# Altium schematic sheet MAIN_BOARD.SchDoc
size C
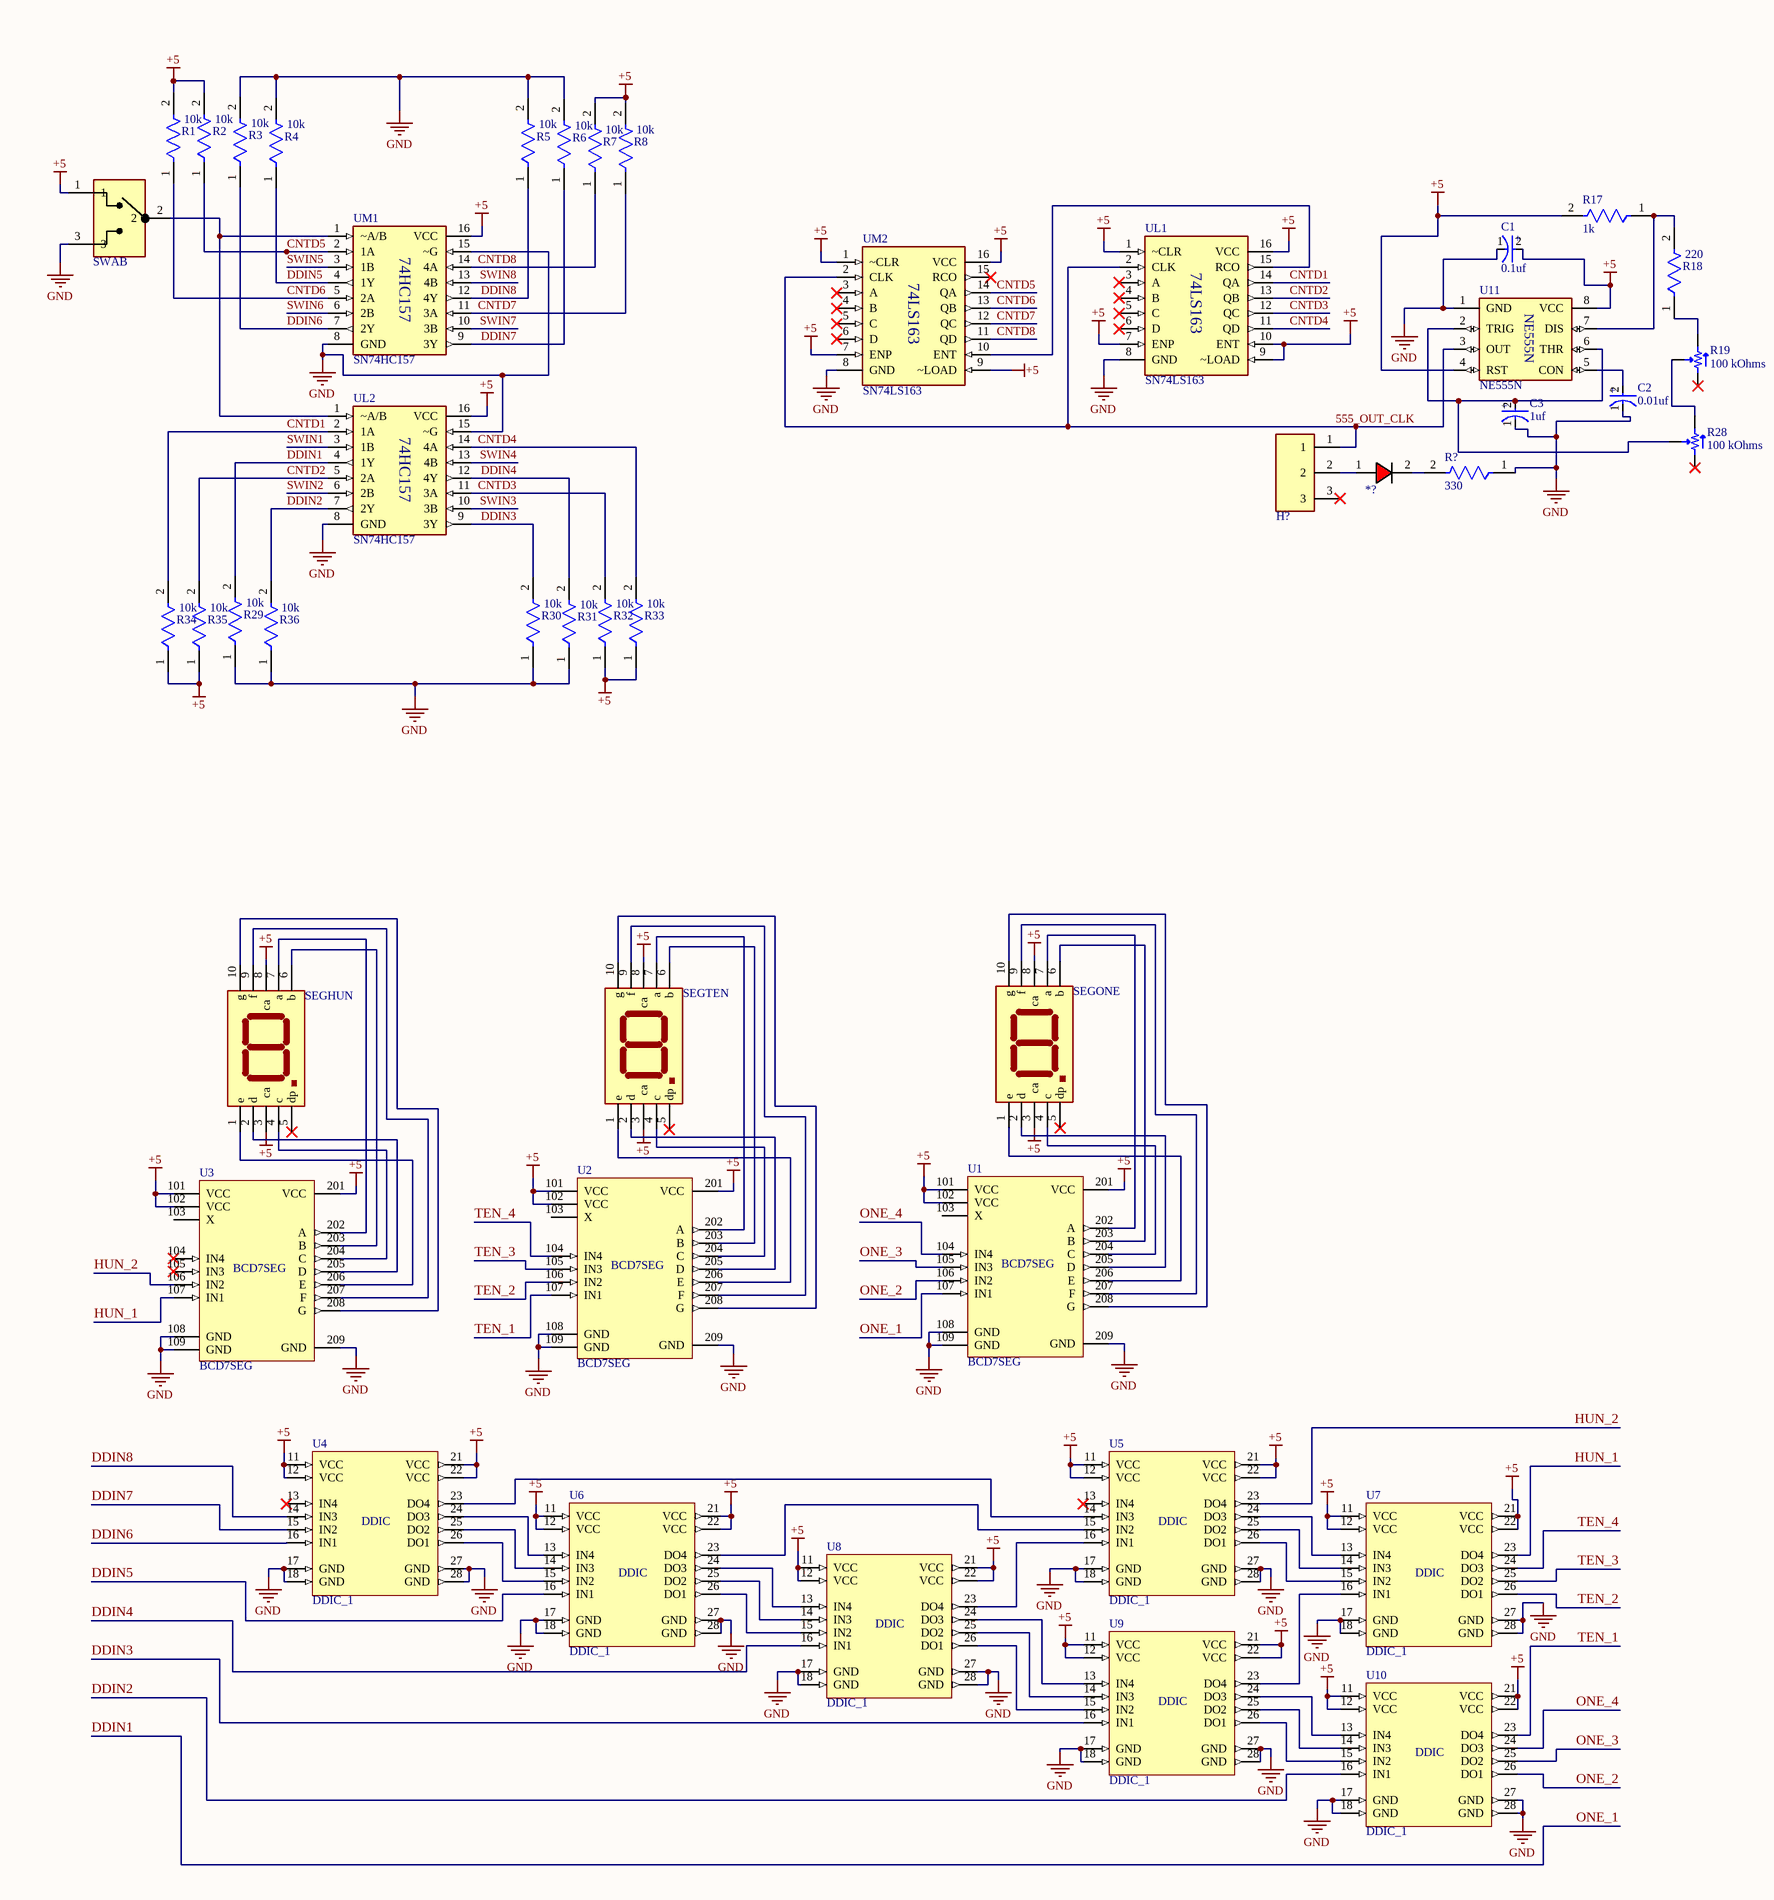
[diagram p0: MAIN_BOARD.SchDoc, left]
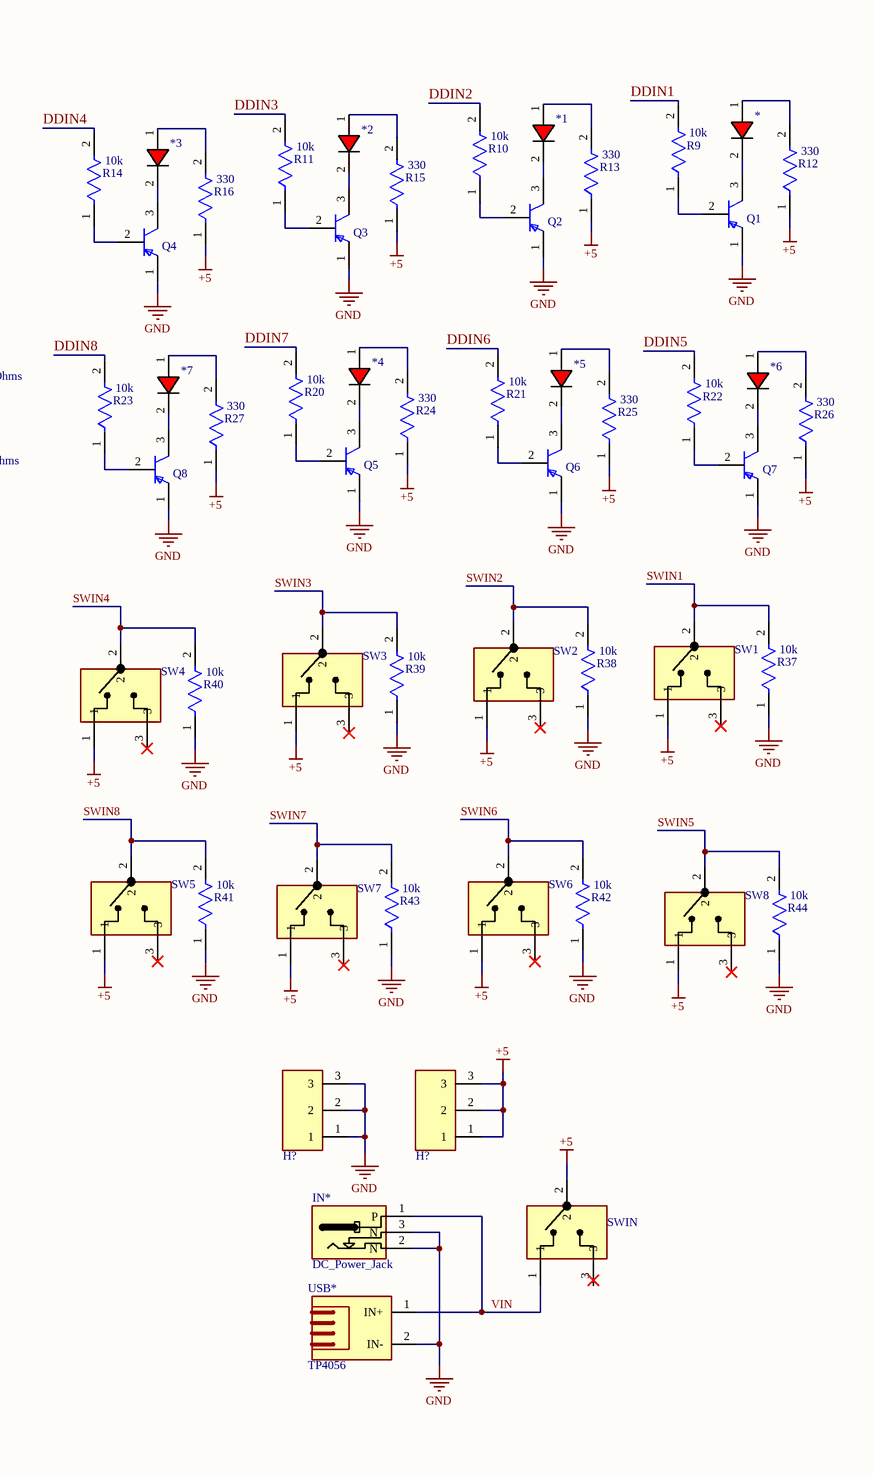
[diagram p1: MAIN_BOARD.SchDoc, right]

## Parts
(Parts that share a designator on the sheet are numbered #1, #2 ... from top to bottom, then left to right.)
*  5mm_RED_LED_3V  [5mm_LED_3V]  (value not drawn)
*1  5mm_RED_LED_3V  [5mm_LED_3V]  (value not drawn)
*2  5mm_RED_LED_3V  [5mm_LED_3V]  (value not drawn)
*3  5mm_RED_LED_3V  [5mm_LED_3V]  (value not drawn)
*4  5mm_RED_LED_3V  [5mm_LED_3V]  (value not drawn)
*5  5mm_RED_LED_3V  [5mm_LED_3V]  (value not drawn)
*6  5mm_RED_LED_3V  [5mm_LED_3V]  (value not drawn)
*7  5mm_RED_LED_3V  [5mm_LED_3V]  (value not drawn)
*?  5mm_RED_LED_3V  [5mm_LED_3V]  (value not drawn)
C1  val: 0.1uf  [Cornell_Dubilier_SK010M050ST_0 - duplicate]  (hidden comment: SK010M050ST_1)
C2  val: 0.01uf  [Cornell_Dubilier_SK010M050ST_0 - duplicate]  (hidden comment: SK010M050ST_1)
C3  val: 1uf  [Cornell_Dubilier_SK010M050ST_0 - duplicate]  (hidden comment: SK010M050ST_1)
H?#1  2.54mm_TH_1x3_pin_header  [2.54mm_TH_1x3_pin_header]  (value not drawn)
H?#2  2.54mm_TH_1x3_pin_header  [2.54mm_TH_1x3_pin_header]  (value not drawn)
H?#3  2.54mm_TH_1x3_pin_header  [2.54mm_TH_1x3_pin_header]  (value not drawn)
IN*  DC_Power_Jack  [DC_Female_Jack]
Q1  BC640TA  [ON_Semiconductor_135AR_MFG]  (value not drawn)
Q2  BC640TA  [ON_Semiconductor_135AR_MFG]  (value not drawn)
Q3  BC640TA  [ON_Semiconductor_135AR_MFG]  (value not drawn)
Q4  BC640TA  [ON_Semiconductor_135AR_MFG]  (value not drawn)
Q5  BC640TA  [ON_Semiconductor_135AR_MFG]  (value not drawn)
Q6  BC640TA  [ON_Semiconductor_135AR_MFG]  (value not drawn)
Q7  BC640TA  [ON_Semiconductor_135AR_MFG]  (value not drawn)
Q8  BC640TA  [ON_Semiconductor_135AR_MFG]  (value not drawn)
R1  VAL: 10k  [TH_Resistor_vertical]  (hidden comment: Res_virtical)
R2  VAL: 10k  [TH_Resistor_vertical]  (hidden comment: Res_virtical)
R3  VAL: 10k  [TH_Resistor_vertical]  (hidden comment: Res_virtical)
R4  VAL: 10k  [TH_Resistor_vertical]  (hidden comment: Res_virtical)
R5  VAL: 10k  [TH_Resistor_vertical]  (hidden comment: Res_virtical)
R6  VAL: 10k  [TH_Resistor_vertical]  (hidden comment: Res_virtical)
R7  VAL: 10k  [TH_Resistor_vertical]  (hidden comment: Res_virtical)
R8  VAL: 10k  [TH_Resistor_vertical]  (hidden comment: Res_virtical)
R9  VAL: 10k  [TH_Resistor_vertical]  (hidden comment: Res_virtical)
R10  VAL: 10k  [TH_Resistor_vertical]  (hidden comment: Res_virtical)
R11  VAL: 10k  [TH_Resistor_vertical]  (hidden comment: Res_virtical)
R12  VAL: 330  [TH_Resistor_vertical]  (hidden comment: Res_virtical)
R13  VAL: 330  [TH_Resistor_vertical]  (hidden comment: Res_virtical)
R14  VAL: 10k  [TH_Resistor_vertical]  (hidden comment: Res_virtical)
R15  VAL: 330  [TH_Resistor_vertical]  (hidden comment: Res_virtical)
R16  VAL: 330  [TH_Resistor_vertical]  (hidden comment: Res_virtical)
R17  VAL: 1k  [TH_Resistor_vertical]  (hidden comment: Res_virtical)
R18  VAL: 220  [TH_Resistor_vertical]  (hidden comment: Res_virtical)
R19  100 kOhms  [BOURNS TRIMPOT 3386P-1]
R20  VAL: 10k  [TH_Resistor_vertical]  (hidden comment: Res_virtical)
R21  VAL: 10k  [TH_Resistor_vertical]  (hidden comment: Res_virtical)
R22  VAL: 10k  [TH_Resistor_vertical]  (hidden comment: Res_virtical)
R23  VAL: 10k  [TH_Resistor_vertical]  (hidden comment: Res_virtical)
R24  VAL: 330  [TH_Resistor_vertical]  (hidden comment: Res_virtical)
R25  VAL: 330  [TH_Resistor_vertical]  (hidden comment: Res_virtical)
R26  VAL: 330  [TH_Resistor_vertical]  (hidden comment: Res_virtical)
R27  VAL: 330  [TH_Resistor_vertical]  (hidden comment: Res_virtical)
R28  100 kOhms  [BOURNS TRIMPOT 3386P-1]
R29  VAL: 10k  [TH_Resistor_vertical]  (hidden comment: Res_virtical)
R30  VAL: 10k  [TH_Resistor_vertical]  (hidden comment: Res_virtical)
R31  VAL: 10k  [TH_Resistor_vertical]  (hidden comment: Res_virtical)
R32  VAL: 10k  [TH_Resistor_vertical]  (hidden comment: Res_virtical)
R33  VAL: 10k  [TH_Resistor_vertical]  (hidden comment: Res_virtical)
R34  VAL: 10k  [TH_Resistor_vertical]  (hidden comment: Res_virtical)
R35  VAL: 10k  [TH_Resistor_vertical]  (hidden comment: Res_virtical)
R36  VAL: 10k  [TH_Resistor_vertical]  (hidden comment: Res_virtical)
R37  VAL: 10k  [TH_Resistor_vertical]  (hidden comment: Res_virtical)
R38  VAL: 10k  [TH_Resistor_vertical]  (hidden comment: Res_virtical)
R39  VAL: 10k  [TH_Resistor_vertical]  (hidden comment: Res_virtical)
R40  VAL: 10k  [TH_Resistor_vertical]  (hidden comment: Res_virtical)
R41  VAL: 10k  [TH_Resistor_vertical]  (hidden comment: Res_virtical)
R42  VAL: 10k  [TH_Resistor_vertical]  (hidden comment: Res_virtical)
R43  VAL: 10k  [TH_Resistor_vertical]  (hidden comment: Res_virtical)
R44  VAL: 10k  [TH_Resistor_vertical]  (hidden comment: Res_virtical)
R?  VAL: 330  [TH_Resistor_vertical]  (hidden comment: Res_virtical)
SEGHUN  7SEG_1DIGIT_CA_1INCH  [7SEG_1DIGIT_CA_1INCH]  (value not drawn)
SEGONE  7SEG_1DIGIT_CA_1INCH  [7SEG_1DIGIT_CA_1INCH]  (value not drawn)
SEGTEN  7SEG_1DIGIT_CA_1INCH  [7SEG_1DIGIT_CA_1INCH]  (value not drawn)
SW1  MTS_102_3P_125V_6A  [MTS_102_3P_125V_6A]  (value not drawn)
SW2  MTS_102_3P_125V_6A  [MTS_102_3P_125V_6A]  (value not drawn)
SW3  MTS_102_3P_125V_6A  [MTS_102_3P_125V_6A]  (value not drawn)
SW4  MTS_102_3P_125V_6A  [MTS_102_3P_125V_6A]  (value not drawn)
SW5  MTS_102_3P_125V_6A  [MTS_102_3P_125V_6A]  (value not drawn)
SW6  MTS_102_3P_125V_6A  [MTS_102_3P_125V_6A]  (value not drawn)
SW7  MTS_102_3P_125V_6A  [MTS_102_3P_125V_6A]  (value not drawn)
SW8  MTS_102_3P_125V_6A  [MTS_102_3P_125V_6A]  (value not drawn)
SWAB  MTS_102_3P_125V_6A  [MTS_102_3P_125V_6A]  (value not drawn)
SWIN  MTS_102_3P_125V_6A  [MTS_102_3P_125V_6A]  (value not drawn)
U1  BCD7SEG  [BCD7SEG]
U2  BCD7SEG  [BCD7SEG]
U3  BCD7SEG  [BCD7SEG]
U4  DDIC_1  [DDIC]
U5  DDIC_1  [DDIC]
U6  DDIC_1  [DDIC]
U7  DDIC_1  [DDIC]
U8  DDIC_1  [DDIC]
U9  DDIC_1  [DDIC]
U10  DDIC_1  [DDIC]
U11  NE555N  [8_DIP]
UL1  SN74LS163  [16_DIP]
UL2  SN74HC157  [16_DIP]
UM1  SN74HC157  [16_DIP]
UM2  SN74LS163  [16_DIP]
USB*  TP4056  [TP4056]

## Nets
+5: C1.2(A) H?#3.1 H?#3.2 H?#3.3 R1.2 R2.2 R7.2 R8.2 R12.1 R13.1 R15.1 R16.1 R17.2 R24.1 R25.1 R26.1 R27.1 R32.1 R33.1 R34.1 R35.1 SEGHUN.3(ca) SEGHUN.8(ca) SEGONE.3(ca) SEGONE.8(ca) SEGTEN.3(ca) SEGTEN.8(ca) SW1.1 SW2.1 SW3.1 SW4.1 SW5.1 SW6.1 SW7.1 SW8.1 SWAB.1 SWIN.2 U1.101(VCC) U1.102(VCC) U1.201(VCC) U2.101(VCC) U2.102(VCC) U2.201(VCC) U3.101(VCC) U3.102(VCC) U3.201(VCC) U4.11(VCC) U4.12(VCC) U4.21(VCC) U4.22(VCC) U5.11(VCC) U5.12(VCC) U5.21(VCC) U5.22(VCC) U6.11(VCC) U6.12(VCC) U6.21(VCC) U6.22(VCC) U7.11(VCC) U7.12(VCC) U7.21(VCC) U7.22(VCC) U8.11(VCC) U8.12(VCC) U8.21(VCC) U8.22(VCC) U9.11(VCC) U9.12(VCC) U9.21(VCC) U9.22(VCC) U10.11(VCC) U10.12(VCC) U10.21(VCC) U10.22(VCC) U11.4(RST) U11.8(VCC) UL1.1(~CLR) UL1.7(ENP) UL1.9(~LOAD) UL1.10(ENT) UL1.16(VCC) UL2.16(VCC) UM1.16(VCC) UM2.1(~CLR) UM2.7(ENP) UM2.9(~LOAD) UM2.16(VCC)
GND: C1.1(C) C2.1(C) C3.1(C) H?#2.1 H?#2.2 H?#2.3 IN*.2(N) IN*.3(N) Q1.1(E) Q2.1(E) Q3.1(E) Q4.1(E) Q5.1(E) Q6.1(E) Q7.1(E) Q8.1(E) R3.2 R4.2 R5.2 R6.2 R29.1 R30.1 R31.1 R36.1 R37.1 R38.1 R39.1 R40.1 R41.1 R42.1 R43.1 R44.1 R?.1 SWAB.3 U1.108(GND) U1.109(GND) U1.209(GND) U2.108(GND) U2.109(GND) U2.209(GND) U3.108(GND) U3.109(GND) U3.209(GND) U4.17(GND) U4.18(GND) U4.27(GND) U4.28(GND) U5.17(GND) U5.18(GND) U5.27(GND) U5.28(GND) U6.17(GND) U6.18(GND) U6.27(GND) U6.28(GND) U7.17(GND) U7.18(GND) U7.27(GND) U7.28(GND) U8.17(GND) U8.18(GND) U8.27(GND) U8.28(GND) U9.17(GND) U9.18(GND) U9.27(GND) U9.28(GND) U10.17(GND) U10.18(GND) U10.27(GND) U10.28(GND) U11.1(GND) UL1.8(GND) UL2.8(GND) UL2.15(~G) UM1.8(GND) UM1.15(~G) UM2.8(GND) USB*.2(IN-)
555_OUT_CLK: H?#1.1 U11.3(OUT) UL1.2(CLK) UM2.2(CLK)
CNTD1: R34.2 UL1.14(QA) UL2.2(1A)
CNTD2: R35.2 UL1.13(QB) UL2.5(2A)
CNTD3: R32.2 UL1.12(QC) UL2.11(3A)
CNTD4: R33.2 UL1.11(QD) UL2.14(4A)
CNTD5: R2.1 UM1.2(1A) UM2.14(QA)
CNTD6: R1.1 UM1.5(2A) UM2.13(QB)
CNTD7: R8.1 UM1.11(3A) UM2.12(QC)
CNTD8: R7.1 UM1.14(4A) UM2.11(QD)
DDIN1: R9.2 R29.2 U1.107(IN1) UL2.4(1Y)  [also labelled ONE_1]
DDIN2: R10.2 R36.2 U10.16(IN1) UL2.7(2Y)
DDIN3: R11.2 R30.2 U9.16(IN1) UL2.9(3Y)
DDIN4: R14.2 R31.2 U8.16(IN1) UL2.12(4Y)
DDIN5: R4.1 R22.2 U6.16(IN1) UM1.4(1Y)
DDIN6: R3.1 R21.2 U4.16(IN1) UM1.7(2Y)
DDIN7: R6.1 R20.2 U4.15(IN2) UM1.9(3Y)
DDIN8: R5.1 R23.2 U4.14(IN3) UM1.12(4Y)
HUN_1: U3.107(IN1) U7.23(DO4)
HUN_2: U3.106(IN2) U5.23(DO4)
ONE_2: U1.106(IN2) U10.26(DO1)
ONE_3: U1.105(IN3) U10.25(DO2)
ONE_4: U1.104(IN4) U10.24(DO3)
SWIN1: R37.2 SW1.2 UL2.3(1B)
SWIN2: R38.2 SW2.2 UL2.6(2B)
SWIN3: R39.2 SW3.2 UL2.10(3B)
SWIN4: R40.2 SW4.2 UL2.13(4B)
SWIN5: R44.2 SW8.2 UM1.3(1B)
SWIN6: R42.2 SW6.2 UM1.6(2B)
SWIN7: R43.2 SW7.2 UM1.10(3B)
SWIN8: R41.2 SW5.2 UM1.13(4B)
TEN_1: U2.107(IN1) U10.23(DO4)
TEN_2: U2.106(IN2) U7.26(DO1)
TEN_3: U2.105(IN3) U7.25(DO2)
TEN_4: U2.104(IN4) U7.24(DO3)
VIN: IN*.1(P) SWIN.1 USB*.1(IN+)
Net*1_1: *1.1 R13.2
Net*1_2: *1.2 Q2.3(C)
Net*2_1: *2.1 R15.2
Net*2_2: *2.2 Q3.3(C)
Net*3_1: *3.1 R16.2
Net*3_2: *3.2 Q4.3(C)
Net*4_1: *4.1 R24.2
Net*4_2: *4.2 Q5.3(C)
Net*5_1: *5.1 R25.2
Net*5_2: *5.2 Q6.3(C)
Net*6_1: *6.1 R26.2
Net*6_2: *6.2 Q7.3(C)
Net*7_1: *7.1 R27.2
Net*7_2: *7.2 Q8.3(C)
Net*?_1: *?.1 H?#1.2
Net*?_2: *?.2 R?.2
Net*_1: *.1 R12.2
Net*_2: *.2 Q1.3(C)
NetC2_2: C2.2(A) U11.5(CON)
NetC3_2: C3.2(A) R28.2 U11.2(TRIG) U11.6(THR)
NetQ1_2: Q1.2(B) R9.1
NetQ2_2: Q2.2(B) R10.1
NetQ3_2: Q3.2(B) R11.1
NetQ4_2: Q4.2(B) R14.1
NetQ5_2: Q5.2(B) R20.1
NetQ6_2: Q6.2(B) R21.1
NetQ7_2: Q7.2(B) R22.1
NetQ8_2: Q8.2(B) R23.1
NetR17_1: R17.1 R18.2 U11.7(DIS)
NetR18_1: R18.1 R19.3
NetR19_2: R19.2 R28.3
NetSEGHUN_1: SEGHUN.1(e) U3.206(E)
NetSEGHUN_2: SEGHUN.2(d) U3.205(D)
NetSEGHUN_4: SEGHUN.4(c) U3.204(C)
NetSEGHUN_6: SEGHUN.6(b) U3.203(B)
NetSEGHUN_7: SEGHUN.7(a) U3.202(A)
NetSEGHUN_9: SEGHUN.9(f) U3.207(F)
NetSEGHUN_10: SEGHUN.10(g) U3.208(G)
NetSEGONE_1: SEGONE.1(e) U1.206(E)
NetSEGONE_2: SEGONE.2(d) U1.205(D)
NetSEGONE_4: SEGONE.4(c) U1.204(C)
NetSEGONE_6: SEGONE.6(b) U1.203(B)
NetSEGONE_7: SEGONE.7(a) U1.202(A)
NetSEGONE_9: SEGONE.9(f) U1.207(F)
NetSEGONE_10: SEGONE.10(g) U1.208(G)
NetSEGTEN_1: SEGTEN.1(e) U2.206(E)
NetSEGTEN_2: SEGTEN.2(d) U2.205(D)
NetSEGTEN_4: SEGTEN.4(c) U2.204(C)
NetSEGTEN_6: SEGTEN.6(b) U2.203(B)
NetSEGTEN_7: SEGTEN.7(a) U2.202(A)
NetSEGTEN_9: SEGTEN.9(f) U2.207(F)
NetSEGTEN_10: SEGTEN.10(g) U2.208(G)
NetSWAB_2: SWAB.2 UL2.1(~A/B) UM1.1(~A/B)
NetU4_23: U4.23(DO4) U5.14(IN3)
NetU4_24: U4.24(DO3) U6.13(IN4)
NetU4_25: U4.25(DO2) U6.14(IN3)
NetU4_26: U4.26(DO1) U6.15(IN2)
NetU5_15: U5.15(IN2) U6.23(DO4)
NetU5_16: U5.16(IN1) U8.23(DO4)
NetU5_24: U5.24(DO3) U7.13(IN4)
NetU5_25: U5.25(DO2) U7.14(IN3)
NetU5_26: U5.26(DO1) U7.15(IN2)
NetU6_24: U6.24(DO3) U8.13(IN4)
NetU6_25: U6.25(DO2) U8.14(IN3)
NetU6_26: U6.26(DO1) U8.15(IN2)
NetU7_16: U7.16(IN1) U9.23(DO4)
NetU8_24: U8.24(DO3) U9.13(IN4)
NetU8_25: U8.25(DO2) U9.14(IN3)
NetU8_26: U8.26(DO1) U9.15(IN2)
NetU9_24: U9.24(DO3) U10.13(IN4)
NetU9_25: U9.25(DO2) U10.14(IN3)
NetU9_26: U9.26(DO1) U10.15(IN2)
NetUL1_15: UL1.15(RCO) UM2.10(ENT)

Not connected (* = marked no-connect by the designer): H?#1 3*; R19 1*; R28 1*; SEGHUN 5(dp)*; SEGONE 5(dp)*; SEGTEN 5(dp)*; SW1 3*; SW2 3*; SW3 3*; SW4 3*; SW5 3*; SW6 3*; SW7 3*; SW8 3*; SWIN 3; U1 103(X); U2 103(X); U3 103(X) 104(IN4)* 105(IN3)*; U4 13(IN4)*; U5 13(IN4)*; UL1 3(A)* 4(B)* 5(C)* 6(D)*; UM2 3(A)* 4(B)* 5(C)* 6(D)* 15(RCO)*

## Notes on the sheet
- (in symbol DDIC_1) DDIC
- (in symbol SK010M050ST_1) +
- (in symbol SN74HC157) 74HC157
- (in symbol SN74LS163) 74LS163

## Library data of the parts
R19 R28 = 3386P-1-104: TRIMMER 100K OHM 0.5W PC PIN TOP; Manufacturer: Bourns Inc.; Adjustment Type: Top Adjustment; Number of Turns: 1; Power (Watts): 0.5W, 1/2W; Resistive Material: Cermet; Temperature Coefficient: ±100ppm/°C; Tolerance: ±10%; Part Number: 3386P-1-104; ComponentLink1Description: Datasheet; ComponentLink1URL: https://www.bourns.com/docs/Product-Datasheets/3386.pdf; ComponentLink2Description: DigiKey Link; ComponentLink2URL: https://www.digikey.com/en/products/detail/bourns-inc/3386P-1-104/86821; LastUpdated: 6/3/2024 8:26:10 PM; Lifecycle Status: Active; Minimum Order: 1; Mounting Type: Through Hole; Packaging: Tube; PartId: 107; Part Status: Active; Price: 1.18; Resistance: 100 kOhms; Series: Trimpot® 3386 - Sealed; Size / Dimension: Square - 0.375" x 0.375" Face (9.53mm x 9.53mm); Supplier 1: DigiKey; Supplier Part Number 1: 3386P-104-ND; Termination Style: PC Pins; Value: 100 kOhms
U11 = NE555N: GENERAL PURPOSE SINGLE BIPOLAR TIMERS
UL1 UM2 = SN74LS163: 3 SYNCHRONOUS 4-BIT COUNTERS.
UL2 UM1 = SN74HC157: SNx4HC157 Quadruple 2-Line to 1-Line Data Selectors/Multiplexers.